# Altium schematic sheet rmstodc.SchDoc
size 297 x 209 mm
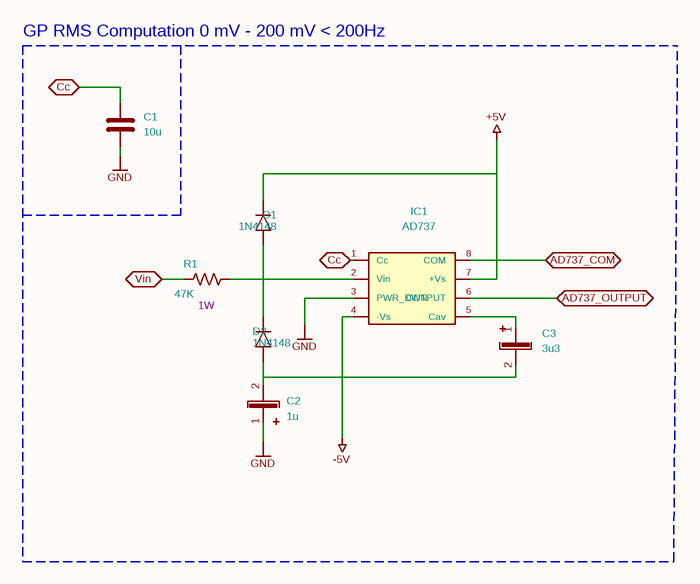
[diagram p0: rmstodc.SchDoc]

## Parts
C1  10u  [C_1206_3216Metric]
C2  1u  [C_1210_3225Metric]
C3  3u3  [C_1210_3225Metric]
D1  1N4148  [D_DO-35_SOD27_P7.62mm_Horizontal]
D2  1N4148  [D_DO-35_SOD27_P7.62mm_Horizontal]
IC1  AD737  [DIP-8_W10.16mm]
R1  Power Rating: 1W  [R_1206_3216Metric]  (hidden comment: 47K)

## Blocks framed on the sheet
GP RMS Computation / 0 mV - 200 mV / < 200Hz: C1-C3 D1 D2 IC1 R1

## Ports
AD737_COM (bidir), AD737_OUTPUT (bidir), Cc (bidir), Vin (bidir)

## Nets
+5V: D1.1(K) IC1.7(+Vs)
-5V: C2.2 C3.2 D2.2(A) IC1.4(-Vs)
GND: C1.2 C2.1 IC1.3(PWR_DWN)
AD737_COM: IC1.8(COM) ; port AD737_COM
AD737_OUTPUT: IC1.6(OUTPUT) ; port AD737_OUTPUT
Cc: C1.1 IC1.1(Cc) ; port Cc
Vin: R1.2 ; port Vin
NetC3_1: C3.1 IC1.5(Cav)
NetD1_2: D1.2(A) D2.1(K) IC1.2(Vin) R1.1

## Notes on the sheet
- 1
- 2
- 3
- 4
- 5
- 6
- A
- B
- C
- AC - DC konvertor
- D
- Title: Uređaj za merenje efektivne vrednosti AC napona
- File: rmstodc.kicad_sch
- Sheet: /
- Srđan Milkić
- KiCad E.D.A.  kicad (5.1.4)-1
- Size: A4
- Date: 2024-01-19
- Rev: 2
- Id: 1/1

## Library data of the parts
C1 = C: Value: 10u; Footprint: Capacitor_SMD:C_1206_3216Metric
C2 = Cap_pol: Value: 1u; Footprint: Capacitor_SMD:C_1210_3225Metric
C3 = Cap_pol_1: Value: 3u3; Footprint: Capacitor_SMD:C_1210_3225Metric
D1 = 1N4148_1: Value: 1N4148; Footprint: Diode_THT:D_DO-35_SOD27_P7.62mm_Horizontal
R1 = R_US: Value: 47K; Footprint: Resistor_SMD:R_1206_3216Metric
D2 = 1N4148: Value: 1N4148; Footprint: Diode_THT:D_DO-35_SOD27_P7.62mm_Horizontal
IC1 = AD737: Value: AD737; Footprint: Package_DIP:DIP-8_W10.16mm